# EAGLE design regulated power supply (EAGLE 9.6.2)
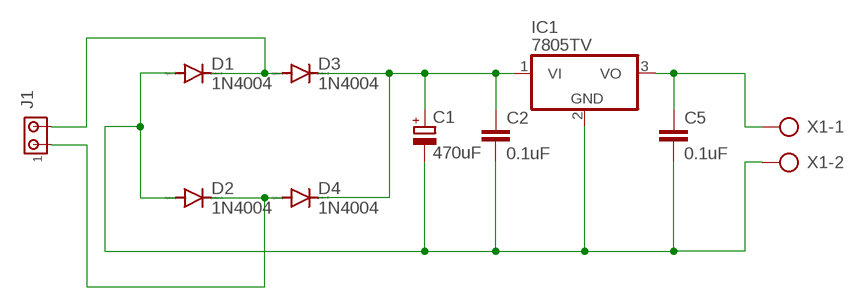
[diagram p0: schematic, sheet 1]

## Parts
C1  470uF  CPOL-EUE2.5-7  [E2,5-7]
C2  0.1uF  C-EU025-050X050  [C025-050X050]
C5  0.1uF  C-EU025-050X050  [C025-050X050]
D1  1N4004  [DO41-10]
D2  1N4004  [DO41-10]
D3  1N4004  [DO41-10]
D4  1N4004  [DO41-10]
IC1  7805TV  [TO220V]
J1  MTA02-100  [10X02MTA]
X1  AK300/2  [AK300/2]

## Nets
N$1: D1.C D3.A J1.2
N$2: D2.C D4.A J1.1
N$3: C1.+ C2.1 D3.C D4.C IC1.1(VI)
N$4: C1.- C2.2 C5.2 D1.A D2.A IC1.2(GND) X1.2
N$5: C5.1 IC1.3(VO) X1.1

## Library data of the parts
C1 = rcl:CPOL-EU: POLARIZED CAPACITOR, European symbol; SPICEPREFIX: C
C2 C5 = rcl:C-EU: CAPACITOR, European symbol; SPICEPREFIX: C
D1-D4 = diode:1N4004: DIODE general purpose rectifier, 1 A
IC1 = linear:78*: Positive VOLTAGE REGULATOR Source: http://cache.national.com/ds/LM/LM78L05.pdf http://www.fairchildsemi.com/ds/LM/LM7805.pdf
J1 = con-amp:MTA02-100: AMP connector
X1 = con-ptr500:AK300/2: CONNECTOR; OC_FARNELL: unknown; OC_NEWARK: unknown

## Board
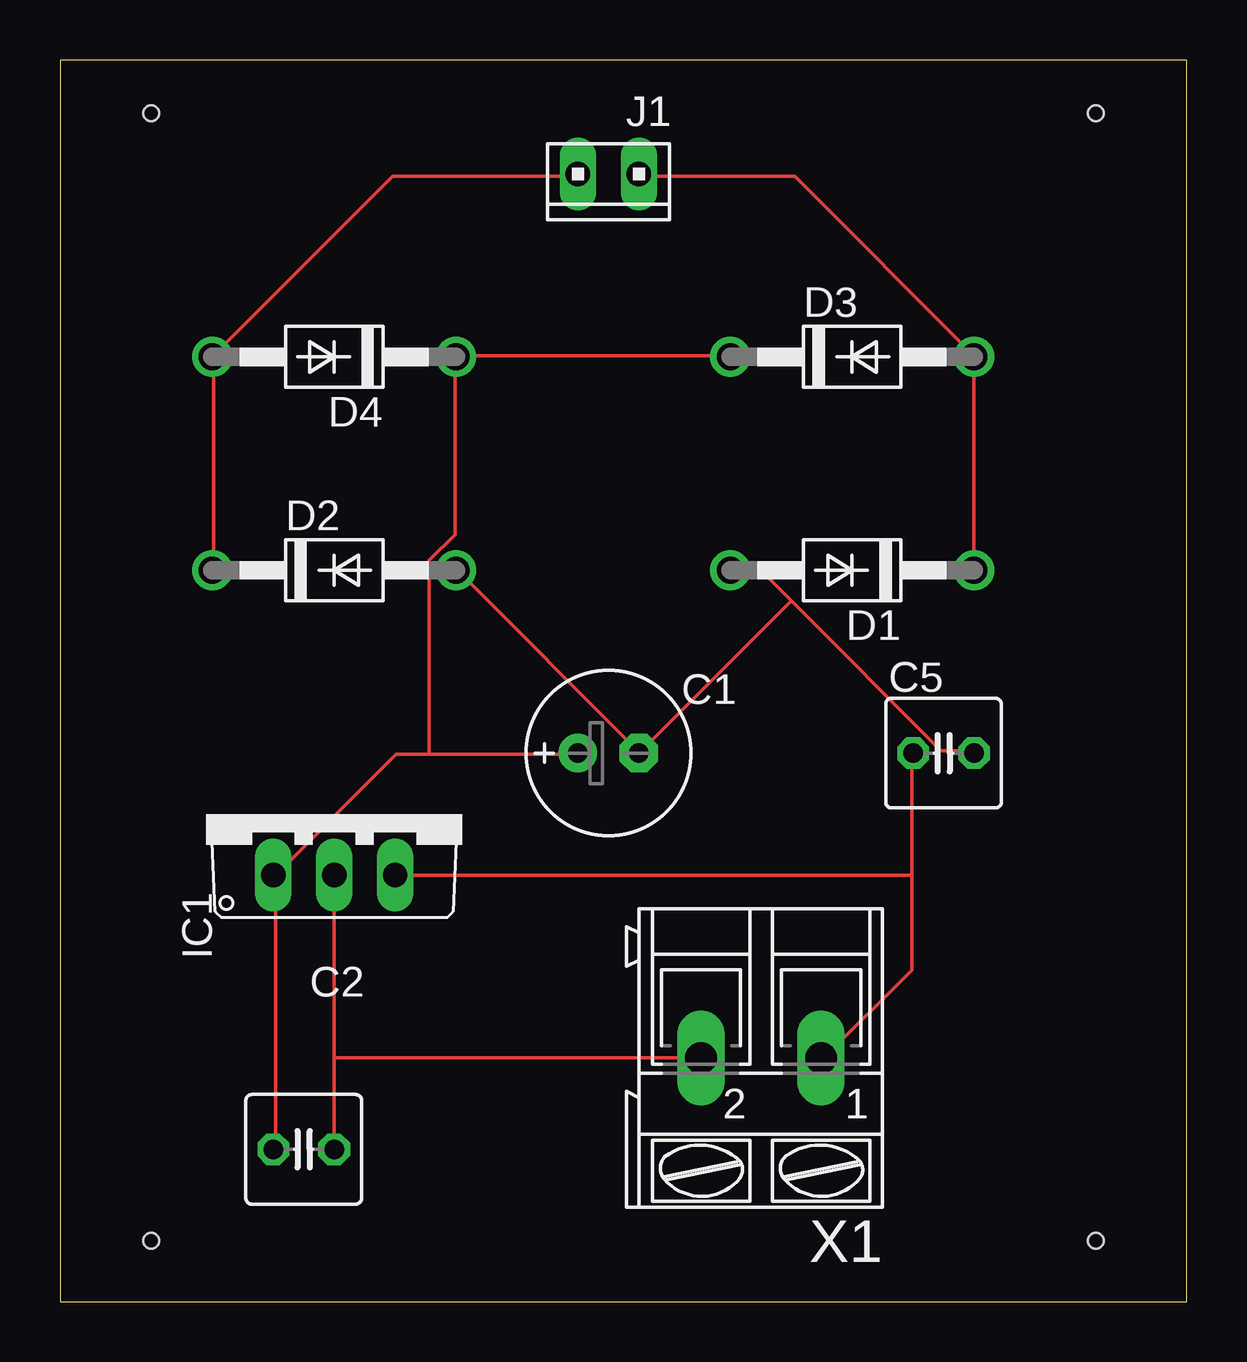
[diagram p1: board, top side]
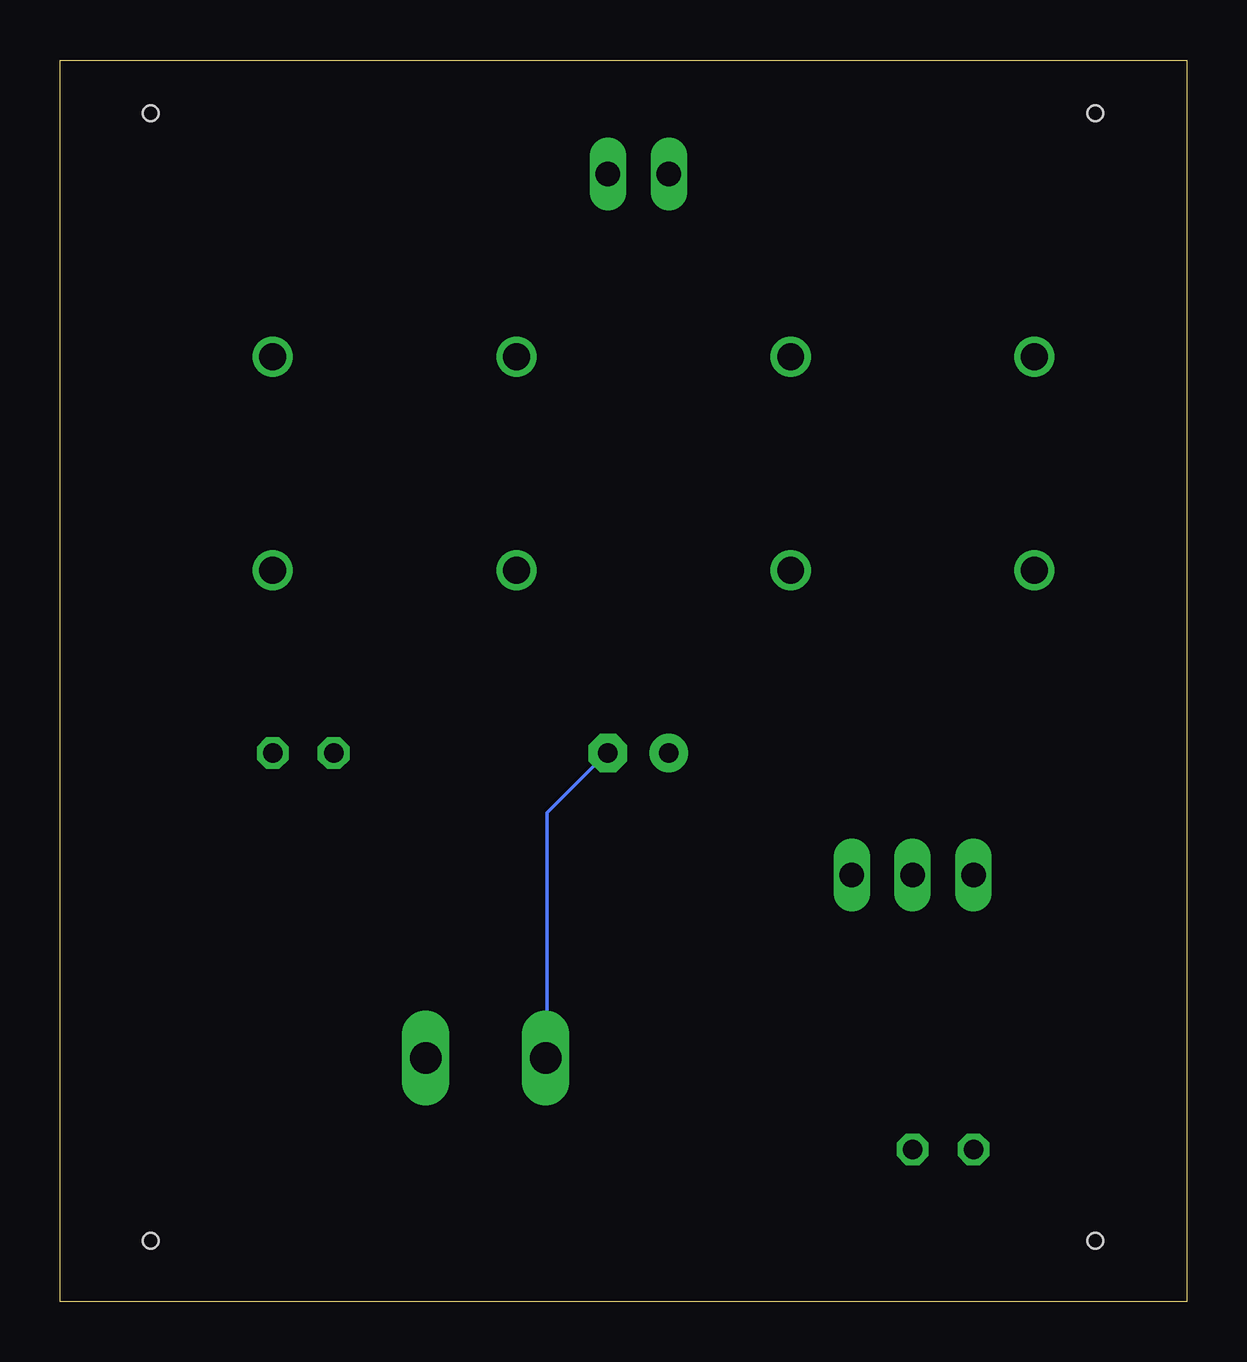
[diagram p2: board, bottom side, seen from below]

Size 46.97 x 51.74 mm. Coordinates in mm from the lower left corner, seen from the top.
Outline: 0,0 46.97,0 46.97,51.74 0,51.74 0,0
Copper layers (1*16): Top 0.035mm / dielectric 1.5mm / Bottom 0.035mm
Design rules "default": minimum track width 6mil, minimum drill 0.35mm, track to track 6mil, track to pad 6mil, pad to pad 6mil, via to via 6mil, smd to smd 6mil, copper to edge 40mil, drill to drill 6mil, minimum pad ring 10mil, minimum via ring 8mil, stop-mask expansion 4mil, vias tented up to drill 0mil, thermal gap 10mil
Holes 0.65 mm at 3.81,49.53 43.18,49.53 43.18,2.54 3.81,2.54

### Footprints (pad centres in the part's own frame; a part is rotated, then mirrored left to right if it is on the bottom)
E2,5-7 = drill 0.813 pad 1.6: + -1.27,0 | drill 0.813 pad 1.6 octagon: - 1.27,0
C025-050X050 = drill 0.813 octagon: 1 -1.27,0; 2 1.27,0
DO41-10 = drill 1.118: A 5.08,0; C -5.08,0
TO220V = drill 1.016 long: 1 -2.54,-2.54; 2 0,-2.54; 3 2.54,-2.54
10X02MTA = drill 1.016 long: 1 1.27,0; 2 -1.27,0
AK300/2 = drill 1.321 long: 1 -2.515,0; 2 2.489,0

### Placement (x,y rotation side)
C1  22.86,22.86 0 top
C2  10.16,6.35 0 top
C5  36.83,22.86 0 top
D1  33.02,30.48 180 top
D2  11.43,30.48 0 top
D3  33.02,39.37 0 top
D4  11.43,39.37 180 top
IC1  11.43,20.32 0 top
J1  22.86,46.99 180 top
X1  29.21,10.16 180 top

### Tracks (layer width: path | path; a pad name or v marks a point on that pad's centre or on a via)
N$1
  Top 0.152: J1.2 24.23,46.89 30.63,46.89 38.1,39.42 D3.A D1.C
N$2
  Top 0.152: J1.1 21.49,46.89 13.87,46.89 D4.A 6.4,39.27 6.4,30.58 D2.C
N$3
  Top 0.152: D3.C 27.89,39.42 16.61,39.42 D4.C 16.46,39.27 16.46,31.95 15.39,30.89 15.39,22.81 | 8.99,17.78 8.99,6.35 C2.1 | 15.39,22.81 14.02,22.81 8.99,17.78 | 15.39,22.81 21.49,22.81 C1.+ | 8.99,17.78 IC1.1
N$4
  Top 0.152: IC1.2 11.43,10.16 | 11.43,10.16 C2.2 | 30.48,29.21 29.26,30.43 28.04,30.43 D1.A | 30.48,29.21 36.73,22.96 38.1,22.96 C5.2 | 30.48,29.21 C1.- 24.08,22.96 16.61,30.43 D2.A | X1.2 11.43,10.16
  Bottom 0.152: X1.2 26.67,10.16 26.67,20.37 24.23,22.81 C1.-
N$5
  Top 0.152: 35.51,17.78 35.51,13.82 31.85,10.16 X1.1 | 35.51,17.78 35.51,22.81 C5.1 | 35.51,17.78 IC1.3